# Altium schematic sheet DS1307.SchDoc
size A; SheetNumber: 6; SheetTotal: 7
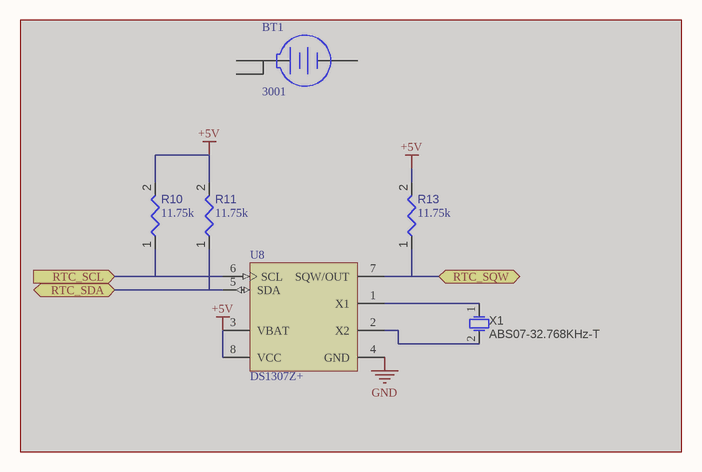
[diagram p0: DS1307.SchDoc]

## Parts
BT1  3001  [KSTN-3001_V]  (masked out: inside a compile mask, not in the netlist)
R10  value 11.75k  [RESC3216X60X45ML15T20]  (hidden comment: Resistor 11.75k +/-1% 1206 250 mW)  (masked out: inside a compile mask, not in the netlist)
R11  value 11.75k  [RESC3216X60X45ML15T20]  (hidden comment: Resistor 11.75k +/-1% 1206 250 mW)  (masked out: inside a compile mask, not in the netlist)
R13  value 11.75k  [RESC3216X60X45ML15T20]  (hidden comment: Resistor 11.75k +/-1% 1206 250 mW)  (masked out: inside a compile mask, not in the netlist)
U8  DS1307Z+  [S8+2_L]  (masked out: inside a compile mask, not in the netlist)
X1  ABS07-32.768KHz-T  [ABRA-ABS07-2_V]  (masked out: inside a compile mask, not in the netlist)

## Ports
RTC_SCL (in), RTC_SDA (bidir), RTC_SQW (bidir)

## Library data of the parts
BT1 = CMP-2000-05463-1: Holder Battery Coin, 12 mm, 2-Pin THD, RoHS; Manufacturer: Keystone; Package Reference: 3001; Package Description: 2-Pin Through Hole Device, Body 13.21 x 12.07 mm; Datasheet Version: Rev. H, 09/2006; Datasheet URL: https://datasheet.ciiva.com/3/3001-3954.pdf; Mounting Technology: ThroughHole; Manufacturer URL: http://www.keyelco.com/
R10 R11 R13 = CMP-009-00016-4: Chip Resistor, 11.75KOhm, +/- 1%, 0.25 W, -55 to 155 degC, 1206 (3216 Metric); Power: 250mW; Voltage Rating: 200V; Max Operating Temperature: 155°C; Mounting Technology: SM; Case/Package: 1206; Pins: 2; Min Operating Temperature: -55°C; RoHS Compliant: True; Tolerance: 1%
U8 = CMP-0254-00308-1: 64 x 8, Serial, I2C Real-Time Clock, 5.0V, 8-Pin SO, 0 to 70 degC, Pb-Free; ComponentLink3Description: Package Specification; DatasheetVersion: 10-Feb-2008; Code_IPC: SOIC127P600-8; ComponentLink2Description: Datasheet; Code_JEDEC: MS-012-AA; ComponentLink2URL: http://datasheets.maxim-ic.com/en/ds/DS1307.pdf; ComponentLink3URL: http://pdfserv.maxim-ic.com/package_dwgs/21-0041.PDF; ComponentLink1URL: http://www.maxim-ic.com; PackageReference: S8+2; ComponentLink1Description: Manufacturer URL; PackageDescription: 8-Pin Small-Outline IC, Narrow (0.15in), 1.27 mm Pitch, SOIC (N), Pb-Free; PackageVersion: revC, 2010
X1 = CMP-003-00022-1: Low Profile Crystal, 32.768 kHz, +/- 20 ppm, 12.5 pF, -40 to 85 degC, 2-Pin SMD, Pb-Free, Tape and Reel; Manufacturer: Abracon; Tolerance: 20ppm; Load Capacitance: 12.5pF; ESR: 70k; Case/Package: CSMD; Datasheet Version: Aug-15; Pins: 2; Max Operating Temperature: 85°C; Package Description: 2-Pin Surface Mount Device, Body 3.2 x 1.5 mm; Manufacturer URL: http://www.abracon.com/; Package URL: http://www.abracon.com/Support/PackageDrawing/Resonators/ABS07.PDF; Min Operating Temperature: -40°C; Packaging: TapeandReel; RoHS Compliant: True; Package Reference: ABS07-2; Frequency Tolerance: 20ppm; Frequency: 32.768kHz; Datasheet URL: http://www.abracon.com/Resonators/ABS07.pdf; Package Quantity: 3000; Mounting Technology: SM